# EAGLE design etch-a-sketch (EAGLE 9.6.2)
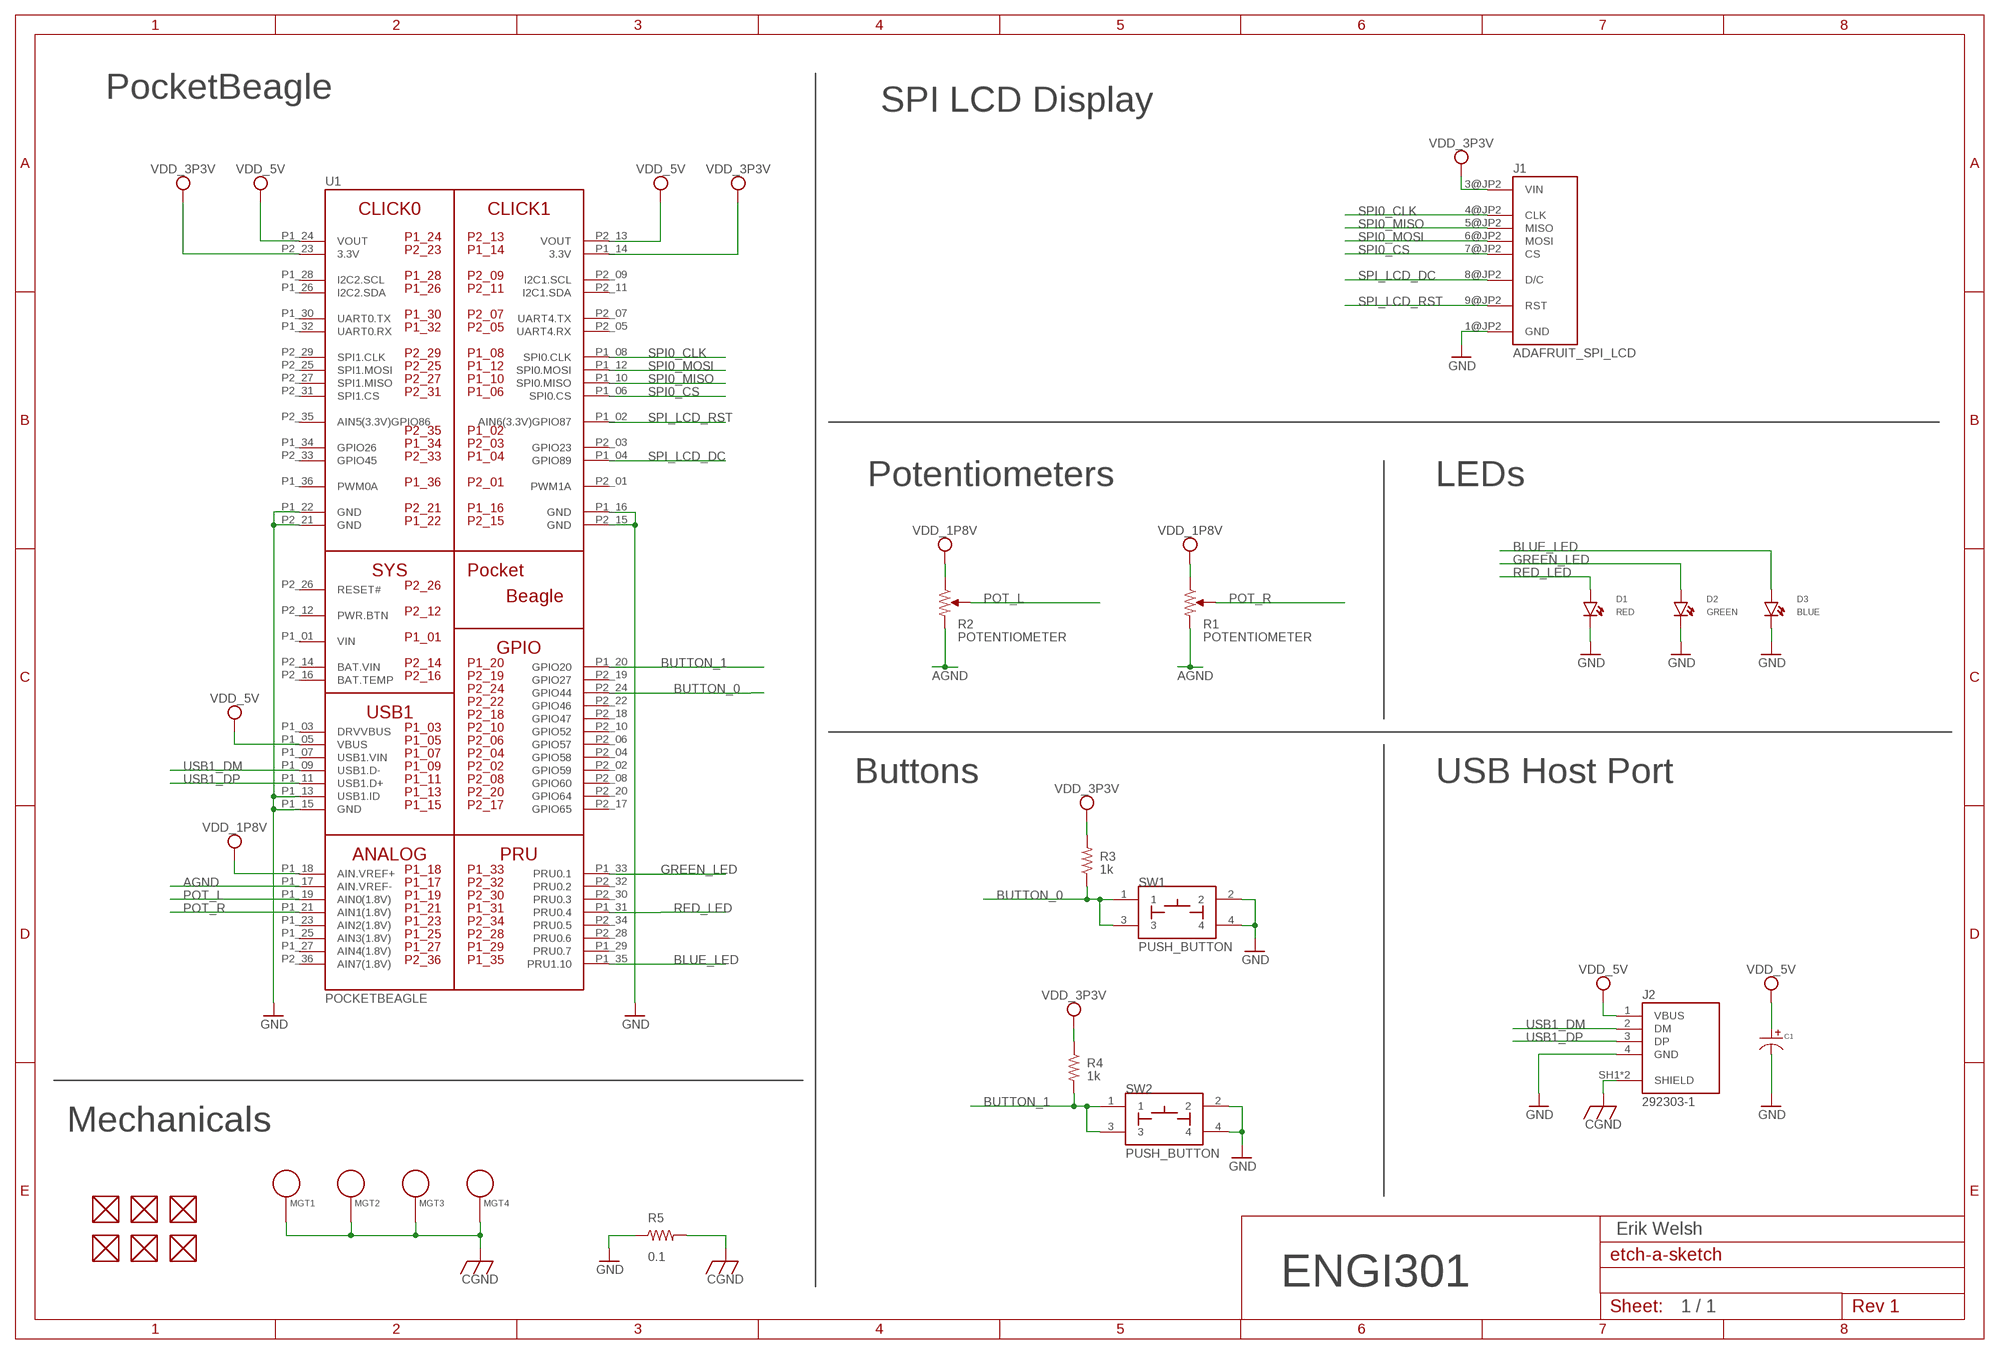
[diagram p0: schematic, sheet 1]

## Parts
C1  CAPACITOR_P_10MM  [CP10MM]
D1  RED  LED  [EIA-STD]
D2  GREEN  LED  [EIA-STD]
D3  BLUE  LED  [EIA-STD]
FUD1  FIDUCIAL  [FIDUCIAL_40MIL]
FUD2  FIDUCIAL  [FIDUCIAL_40MIL]
FUD3  FIDUCIAL  [FIDUCIAL_40MIL]
FUD4  FIDUCIAL  [FIDUCIAL_40MIL]
FUD5  FIDUCIAL  [FIDUCIAL_40MIL]
FUD6  FIDUCIAL  [FIDUCIAL_40MIL]
J1  ADAFRUIT_SPI_LCD  [SPI_LCD_DISPLAY]
J2  292303-1  [TE_292303-1]
MGT1  MOUNTING_HOLE  [MOUNTING_HOLE]
MGT2  MOUNTING_HOLE  [MOUNTING_HOLE]
MGT3  MOUNTING_HOLE  [MOUNTING_HOLE]
MGT4  MOUNTING_HOLE  [MOUNTING_HOLE]
R1  POTENTIOMETER  [POT-PO90S]
R2  POTENTIOMETER  [POT-PO90S]
R3  1k  R_R0603  [R0603]
R4  1k  R_R0603  [R0603]
R5  0.1  R_R0805  [R0805]
SW1  PUSH_BUTTON  [BUTTON_12.5MM]
SW2  PUSH_BUTTON  [BUTTON_12.5MM]
U1  POCKETBEAGLE  [POCKETBEAGLE]

## Nets
AGND: R1.CW R2.CW U1.P1_17(AIN.VREF-)
BLUE_LED: D3.ANODE U1.P1_35(PRU1.10)
BUTTON_0: R3.1 SW1.1 SW1.3 U1.P2_24(GPIO44)
BUTTON_1: R4.2 SW2.1 SW2.3 U1.P1_20(GPIO20)
CGND: J2.SH1(SHIELD) J2.SH2(SHIELD) MGT1.P$1 MGT2.P$1 MGT3.P$1 MGT4.P$1 R5.2
GND: C1.P$2 D1.CATHODE D2.CATHODE D3.CATHODE J1.1@JP2(GND) J2.4(GND) R5.1 SW1.2 SW1.4 SW2.2 SW2.4 U1.P1_13(USB1.ID) U1.P1_15(GND) U1.P1_16(GND) U1.P1_22(GND) U1.P2_15(GND) U1.P2_21(GND)
GREEN_LED: D2.ANODE U1.P1_33(PRU0.1)
N$2: U1.P1_14(3.3V) ; supply symbol labelled VDD_3P3V
POT_L: R2.S U1.P1_19(AIN0(1.8V))
POT_R: R1.S U1.P1_21(AIN1(1.8V))
RED_LED: D1.ANODE U1.P1_31(PRU0.4)
SPI0_CLK: J1.4@JP2(CLK) U1.P1_08(SPI0.CLK)
SPI0_CS: J1.7@JP2(CS) U1.P1_06(SPI0.CS)
SPI0_MISO: J1.5@JP2(MISO) U1.P1_10(SPI0.MISO)
SPI0_MOSI: J1.6@JP2(MOSI) U1.P1_12(SPI0.MOSI)
SPI_LCD_DC: J1.8@JP2(D/C) U1.P1_04(GPIO89)
SPI_LCD_RST: J1.9@JP2(RST) U1.P1_02(AIN6(3.3V)GPIO87)
USB1_DM: J2.2(DM) U1.P1_09(USB1.D-)
USB1_DP: J2.3(DP) U1.P1_11(USB1.D+)
VDD_1P8V: R1.CCW R2.CCW U1.P1_18(AIN.VREF+)
VDD_3P3V: J1.3@JP2(VIN) R3.2 R4.1 U1.P2_23(3.3V)
VDD_5V: C1.P$1 J2.1(VBUS) U1.P1_05(VBUS) U1.P1_24(VOUT) U1.P2_13(VOUT)
Unconnected: FUD1.P$1 FUD2.P$1 FUD3.P$1 FUD4.P$1 FUD5.P$1 FUD6.P$1 U1.P1_03(DRVVBUS) U1.P1_07(USB1.VIN) U1.P1_23(AIN2(1.8V)) U1.P1_25(AIN3(1.8V)) U1.P1_26(I2C2.SDA) U1.P1_27(AIN4(1.8V)) U1.P1_28(I2C2.SCL) U1.P1_29(PRU0.7) U1.P1_30(UART0.TX) U1.P1_32(UART0.RX) U1.P1_34(GPIO26) U1.P1_36(PWM0A) U1.P2_01(PWM1A) U1.P2_02(GPIO59) U1.P2_03(GPIO23) U1.P2_04(GPIO58) U1.P2_05(UART4.RX) U1.P2_06(GPIO57) U1.P2_07(UART4.TX) U1.P2_08(GPIO60) U1.P2_09(I2C1.SCL) U1.P2_10(GPIO52) U1.P2_11(I2C1.SDA) U1.P2_12(PWR.BTN) U1.P2_16(BAT.TEMP) U1.P2_17(GPIO65) U1.P2_18(GPIO47) U1.P2_19(GPIO27) U1.P2_20(GPIO64) U1.P2_22(GPIO46) U1.P2_25(SPI1.MOSI) U1.P2_26(RESET#) U1.P2_27(SPI1.MISO) U1.P2_28(PRU0.6) U1.P2_29(SPI1.CLK) U1.P2_30(PRU0.3) U1.P2_31(SPI1.CS) U1.P2_32(PRU0.2) U1.P2_33(GPIO45) U1.P2_34(PRU0.5) U1.P2_35(AIN5(3.3V)GPIO86) U1.P2_36(AIN7(1.8V))

## Notes on the sheet
- PocketBeagle
- SPI LCD Display
- Potentiometers | LEDs
- Buttons | USB Host Port
- Mechanicals
- Erik Welsh
- ENGI301
- 1 / 1

## Power pins joined to a net without a drawn wire
BAT.VIN: U1.P2_14(BAT.VIN)
VIN: U1.P1_01(VIN)

## Library data of the parts
C1 = etch-a-sketch:CAPACITOR_P: Library: MF_Passives Description: Device for Polarized Capacitors. Manufacture part number (MPN), Voltage Rating, and Tolerance can be added via Attributes. Check https://factory.macrofab.com/parts for the house parts list.; POPULATE: 1
D1-D3 = etch-a-sketch:LED: EIA-STD LED, LTST-C191TBKT
FUD1-FUD6 = etch-a-sketch:FIDUCIAL
J1 = etch-a-sketch:ADAFRUIT_SPI_LCD
J2 = etch-a-sketch:292303-1: CONN USB RECEPT R/A TYPE A 4POS Check availability <https://pricing.snapeda.com/parts/292303-1/TE%20Connectivity/view-part?ref=eda>; AVAILABILITY: In Stock; CENTERLINE_PITCH: 2 mm[.078 in]; COMMENT: 292303-1; DESCRIPTION: Conn; Data; USB; Recept; 2.0; 4 Pos; 1 Port; Rt Angle; A Ser; Tin over Copper; EU_ROHS_COMPLIANCE: Compliant; MF: TE Connectivity; MP: 292303-1; NUMBER_OF_POSITIONS: 4; PACKAGE: None; PRICE: None; PRODUCT_TYPE: Connector; PURCHASE-URL: https://pricing.snapeda.com/search/part/292303-1/?ref=eda
MGT1-MGT4 = etch-a-sketch:MOUNTING_HOLE: Chassis Mounting Hole w/GND connection ability
R1 R2 = etch-a-sketch:POTENTIOMETER: Potentiometer - Examples: P090S-14T20BR10K (987-1277-ND)
R3-R5 = etch-a-sketch:R_: RESISTOR, American symbol
SW1 SW2 = etch-a-sketch:PUSH_BUTTON
U1 = etch-a-sketch:POCKETBEAGLE

## Board
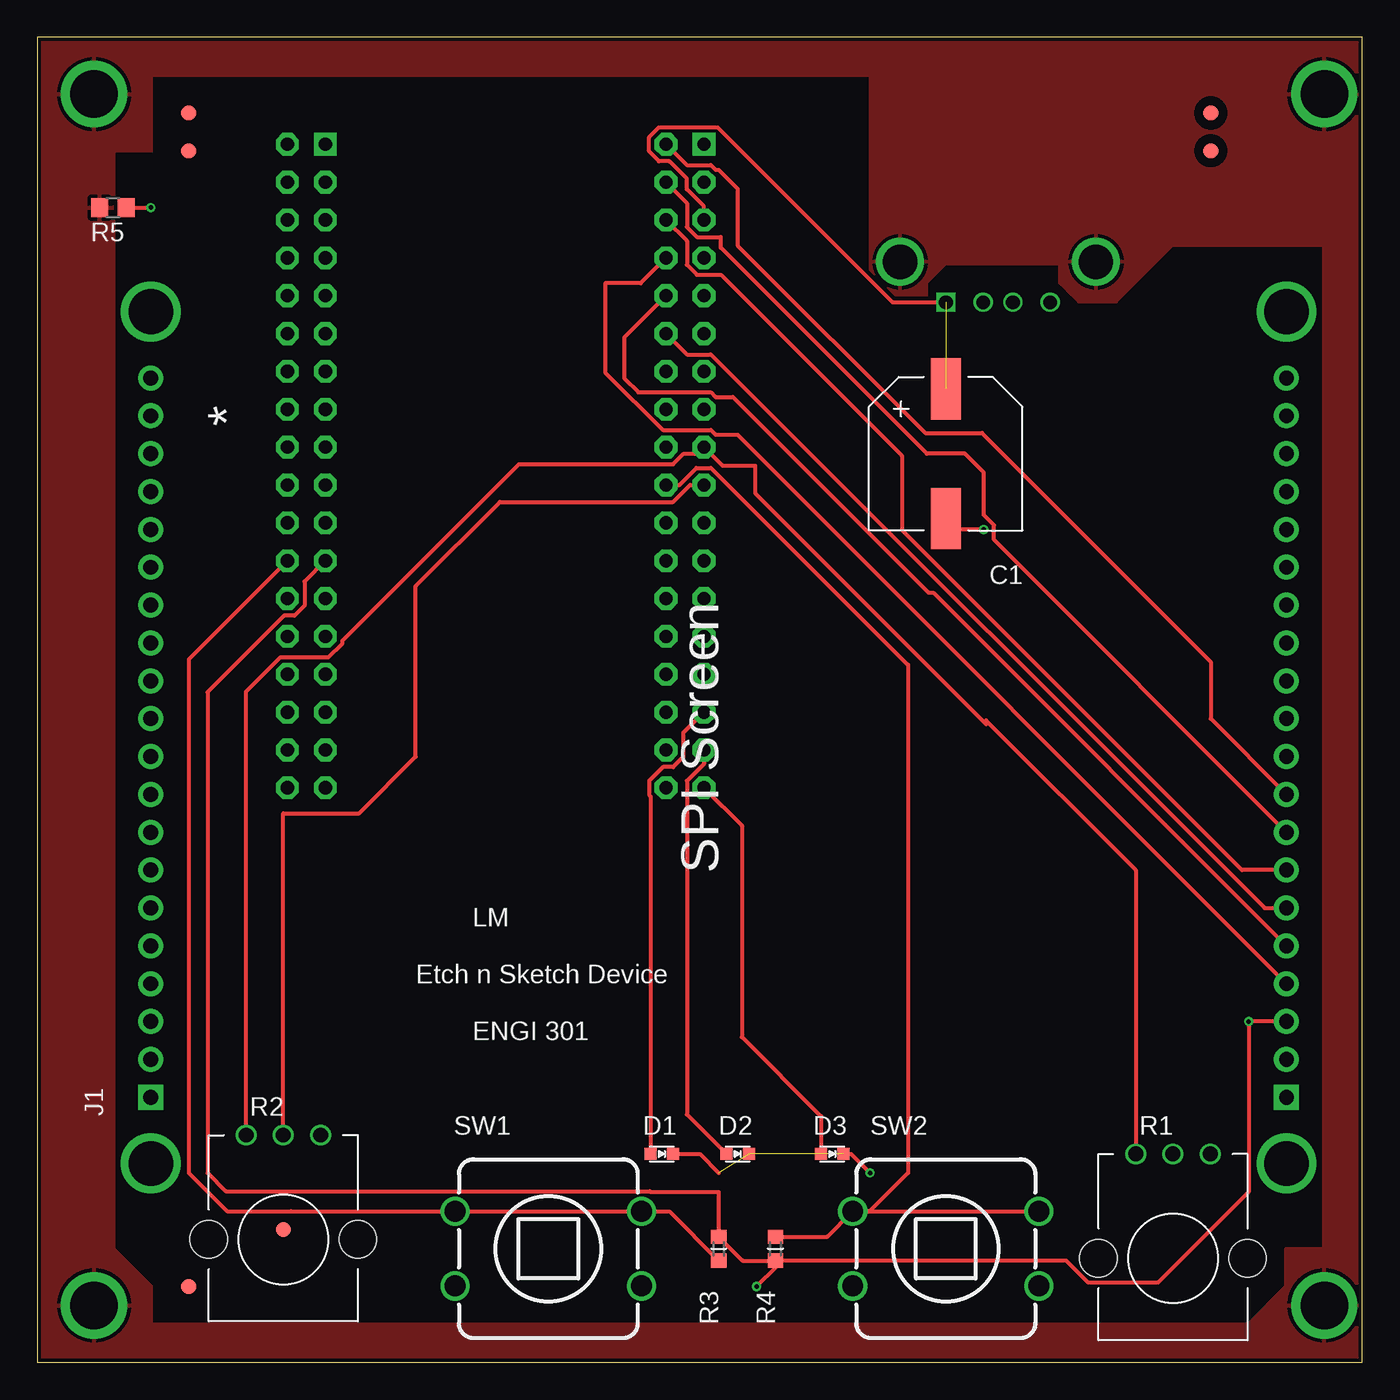
[diagram p1: board, top side]
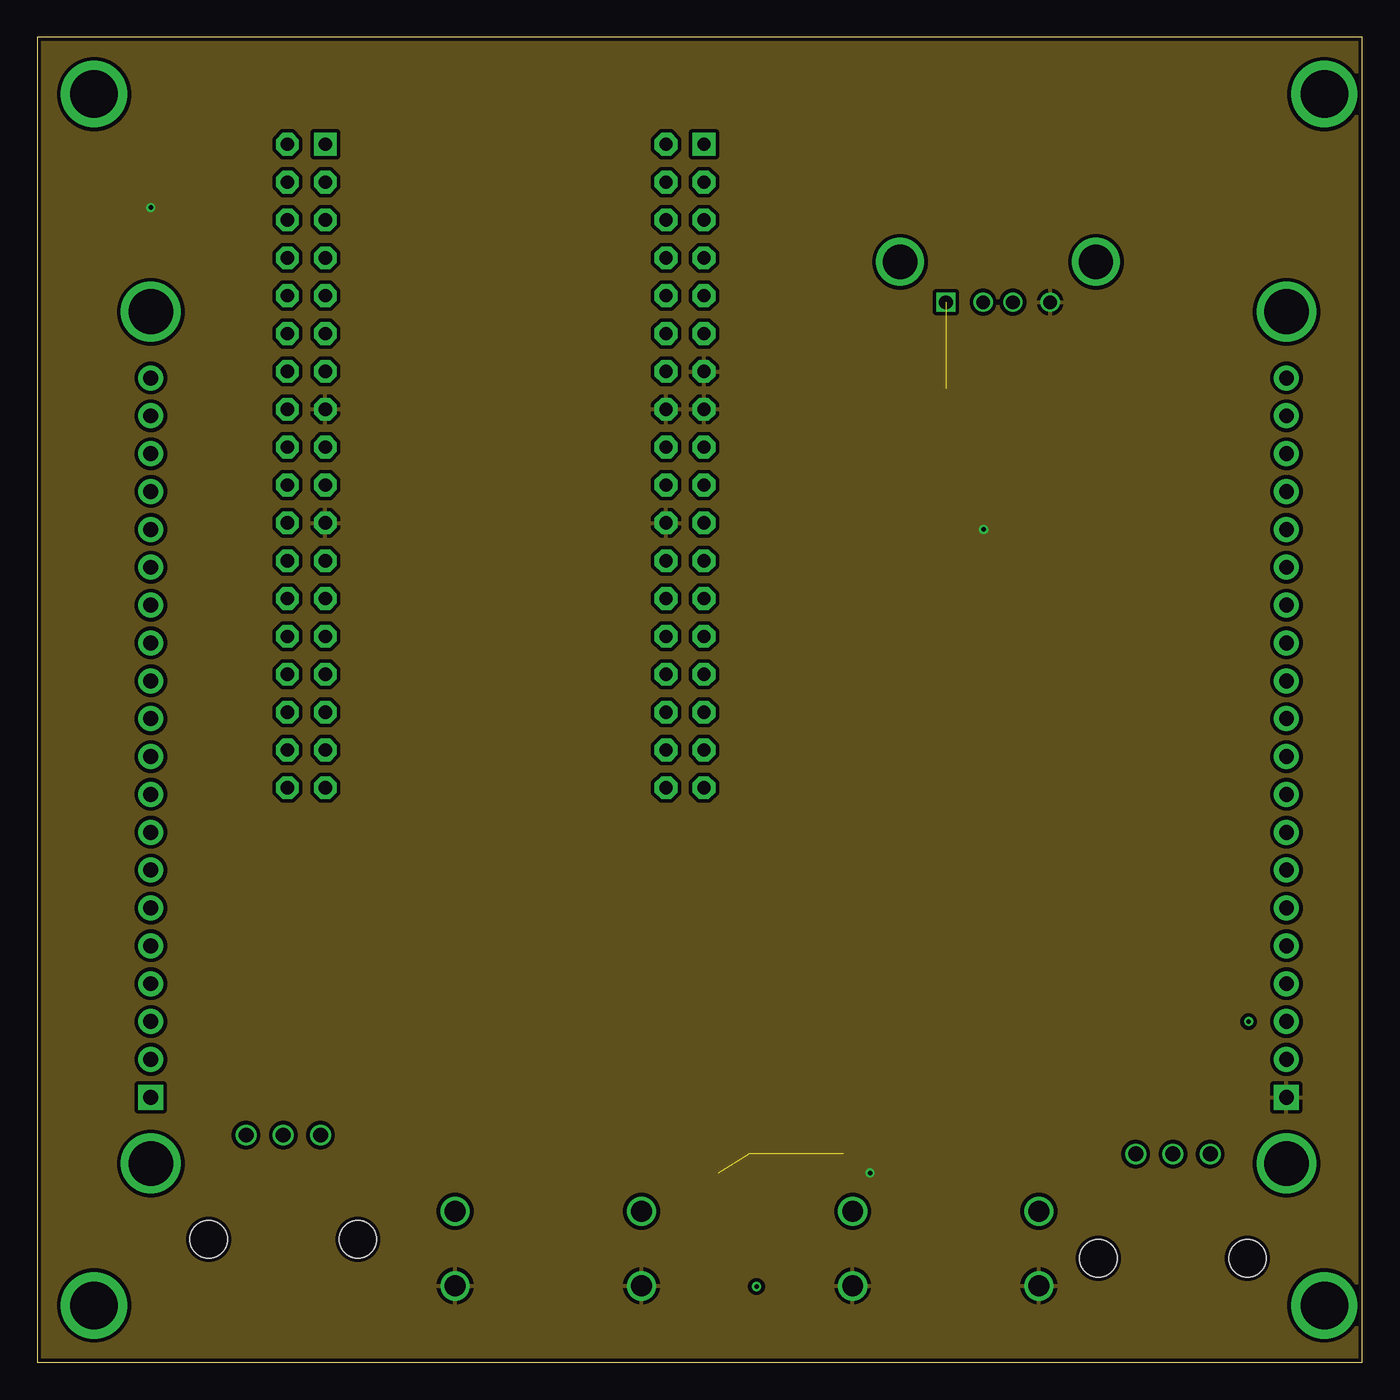
[diagram p2: board, inner layer Route2]
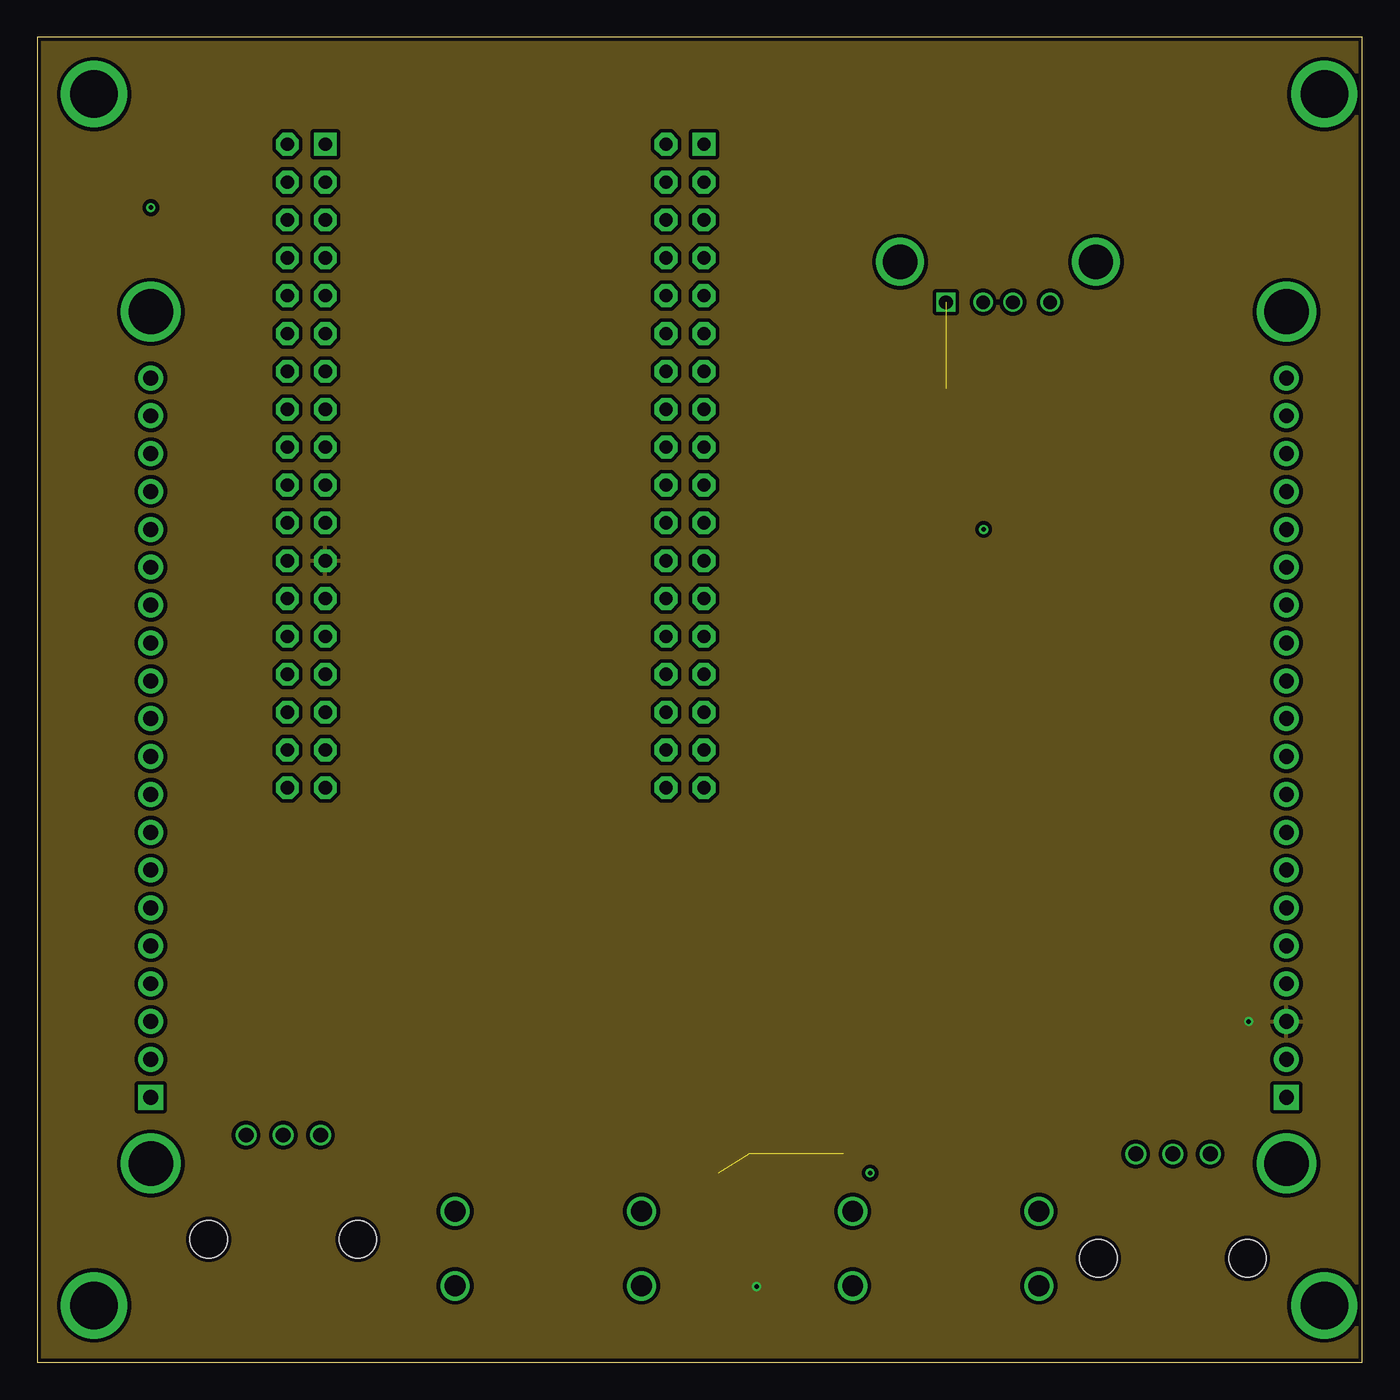
[diagram p3: board, inner layer Route15]
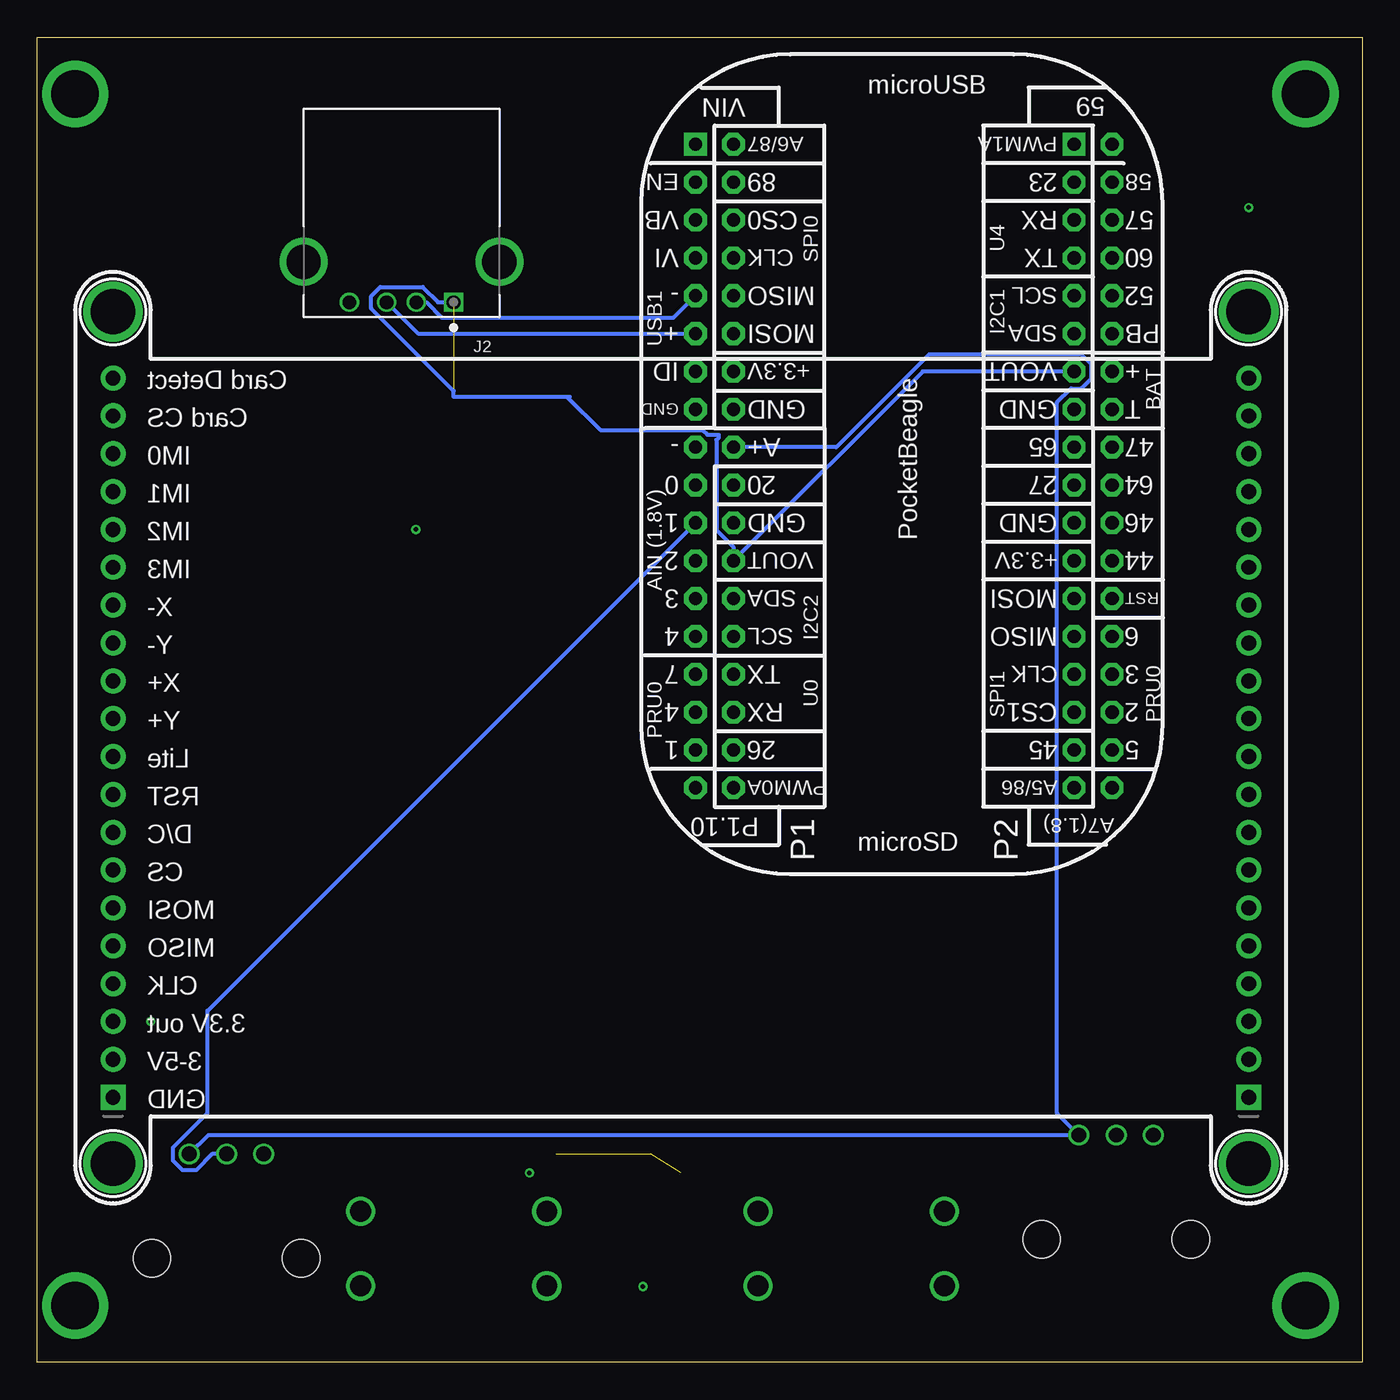
[diagram p4: board, bottom side, seen from below]

Size 88.9 x 88.9 mm. Coordinates in mm from the lower left corner, seen from the top.
Outline: 0,0 88.9,0 88.9,88.9 0,88.9 0,0
Copper layers (1*2*15*16): Top 0.035mm / dielectric 0.23mm / Route2 0.035mm / dielectric 0.93mm / Route15 0.035mm / dielectric 0.23mm / Bottom 0.035mm
Design rules "ENGI301_4lyr": minimum track width 10mil, minimum drill 12mil, track to track 10mil, track to pad 10mil, pad to pad 10mil, via to via 10mil, smd to smd 10mil, copper to edge 10mil, drill to drill 12mil, minimum pad ring 6mil, minimum via ring 6mil, stop-mask expansion 3mil, vias tented up to drill 25mil, thermal gap 10mil

### Footprints (pad centres in the part's own frame; a part is rotated, then mirrored left to right if it is on the bottom)
CP10MM = smd 2 x 4.1: P$1 0,-4.35; P$2 0,4.35
EIA-STD = smd 0.8 x 0.8: ANODE -0.75,0; CATHODE 0.75,0
FIDUCIAL_40MIL = smd 1.016 x 1.016: P$1 0,0
SPI_LCD_DISPLAY = drill 1 pad 1.676 square: 1@JP1 -24.13,38.1; 1@JP2 -24.13,-38.1 | drill 1 pad 1.676: 2@JP1 -21.59,38.1; 2@JP2 -21.59,-38.1; 3@JP1 -19.05,38.1; 3@JP2 -19.05,-38.1; 4@JP1 -16.51,38.1; 4@JP2 -16.51,-38.1; 5@JP1 -13.97,38.1; 5@JP2 -13.97,-38.1; 6@JP1 -11.43,38.1; 6@JP2 -11.43,-38.1; 7@JP1 -8.89,38.1; 7@JP2 -8.89,-38.1; 8@JP1 -6.35,38.1; 8@JP2 -6.35,-38.1; 9@JP1 -3.81,38.1; 9@JP2 -3.81,-38.1; 10@JP1 -1.27,38.1; 10@JP2 -1.27,-38.1; 11@JP1 1.27,38.1; 11@JP2 1.27,-38.1; 12@JP1 3.81,38.1; 12@JP2 3.81,-38.1; 13@JP1 6.35,38.1; 13@JP2 6.35,-38.1; 14@JP1 8.89,38.1; 14@JP2 8.89,-38.1; 15@JP1 11.43,38.1; 15@JP2 11.43,-38.1; 16@JP1 13.97,38.1; 16@JP2 13.97,-38.1; 17@JP1 16.51,38.1; 17@JP2 16.51,-38.1; 18@JP1 19.05,38.1; 18@JP2 19.05,-38.1; 19@JP1 21.59,38.1; 19@JP2 21.59,-38.1; 20@JP1 24.13,38.1; 20@JP2 24.13,-38.1 | drill 3 pad 3.6: P$1@U$7 28.575,-38.1; P$1@U$15 -28.575,-38.1; P$1@U$16 28.575,38.1; P$1@U$17 -28.575,38.1
TE_292303-1 = drill 0.92 square: 1 0,0 | drill 0.92: 2 2.5,0; 3 4.5,0; 4 7,0 | drill 2.3: SH1 -3.07,-2.71; SH2 10.07,-2.71
MOUNTING_HOLE = drill 3.175 pad 4.445: P$1 0,0
POT-PO90S = drill 1: CCW -2.5,0; CW 2.5,0; S 0,0 | hole 2.5: -5,7; 5,7
R0603 = smd 0.95 x 1.031: 1 -0.8,0; 2 0.8,0
R0805 = smd 1.143 x 1.27: 1 -0.889,0; 2 0.889,0
BUTTON_12.5MM = drill 1.4: 1 -6.25,2.5; 2 -6.25,-2.5; 3 6.25,2.5; 4 6.25,-2.5
POCKETBEAGLE = drill 0.889 pad 1.524 square: P1_01 5.91,3.53; P2_01 5.91,28.93 | drill 0.889 pad 1.524 octagon: P1_02 5.91,6.07; P1_03 8.45,3.53; P1_04 8.45,6.07; P1_05 10.99,3.53; P1_06 10.99,6.07; P1_07 13.53,3.53; P1_08 13.53,6.07; P1_09 16.07,3.53; P1_10 16.07,6.07; P1_11 18.61,3.53; P1_12 18.61,6.07; P1_13 21.15,3.53; P1_14 21.15,6.07; P1_15 23.69,3.53; P1_16 23.69,6.07; P1_17 26.23,3.53; P1_18 26.23,6.07; P1_19 28.77,3.53; P1_20 28.77,6.07; P1_21 31.31,3.53; P1_22 31.31,6.07; P1_23 33.85,3.53; P1_24 33.85,6.07; P1_25 36.39,3.53; P1_26 36.39,6.07; P1_27 38.93,3.53; P1_28 38.93,6.07; P1_29 41.47,3.53; P1_30 41.47,6.07; P1_31 44.01,3.53; P1_32 44.01,6.07; P1_33 46.55,3.53; P1_34 46.55,6.07; P1_35 49.09,3.53; P1_36 49.09,6.07; P2_02 5.91,31.47; P2_03 8.45,28.93; P2_04 8.45,31.47; P2_05 10.99,28.93; P2_06 10.99,31.47; P2_07 13.53,28.93; P2_08 13.53,31.47; P2_09 16.07,28.93; P2_10 16.07,31.47; P2_11 18.61,28.93; P2_12 18.61,31.47; P2_13 21.15,28.93; P2_14 21.15,31.47; P2_15 23.69,28.93; P2_16 23.69,31.47; P2_17 26.23,28.93; P2_18 26.23,31.47; P2_19 28.77,28.93; P2_20 28.77,31.47; P2_21 31.31,28.93; P2_22 31.31,31.47; P2_23 33.85,28.93; P2_24 33.85,31.47; P2_25 36.39,28.93; P2_26 36.39,31.47; P2_27 38.93,28.93; P2_28 38.93,31.47; P2_29 41.47,28.93; P2_30 41.47,31.47; P2_31 44.01,28.93; P2_32 44.01,31.47; P2_33 46.55,28.93; P2_34 46.55,31.47; P2_35 49.09,28.93; P2_36 49.09,31.47

### Placement (x,y rotation side)
C1  60.96,60.96 180 top
D1  41.91,13.97 0 top
D2  46.99,13.97 0 top
D3  53.34,13.97 0 top
FUD1  10.16,83.82 0 top
FUD2  10.16,81.28 0 top
FUD3  78.74,83.82 0 top
FUD4  78.74,81.28 0 top
FUD5  10.16,5.08 0 top
FUD6  16.51,8.89 0 top
J1  45.72,41.91 90 top
J2  60.96,71.12 180 bottom
MGT1  3.81,85.09 0 top
MGT2  3.81,3.81 0 top
MGT3  86.36,3.81 0 top
MGT4  86.36,85.09 0 top
R1  76.2,13.97 180 top
R2  16.51,15.24 180 top
R3  45.72,7.62 90 top
R4  49.53,7.62 90 top
R5  5.08,77.47 180 top
SW1  34.29,7.62 0 top
SW2  60.96,7.62 0 top
U1  48.26,87.63 270 bottom

### Tracks (layer width: path | path; a pad name or v marks a point on that pad's centre or on a via)
AGND
  Top 0.254: R1.CW 73.7,33.02 63.65,43.07 63.65,42.82 48.16,58.32 48.16,60.13 46,60.13 U1.P1_17 44.73,60.96 43.37,60.96 42.66,60.26 32.32,60.26 20.47,48.41 20.47,48.23 19.55,47.3 16.32,47.3 14.01,45 R2.CW
BLUE_LED
  Top 0.254: U1.P1_35 47.27,36 47.27,21.83 52.59,16.51 D3.ANODE
BUTTON_0
  Top 0.254: R3.1 42.42,10.12 SW1.3 SW1.1 17.03,10.12 17.02,10.13 12.73,10.13 10.16,12.7 10.16,47.15 U1.P2_24
BUTTON_1
  Top 0.254: R4.2 53.01,8.42 SW2.1 | SW2.1 SW2.3 | U1.P1_20 43.09,58.86 44.23,60 45.2,60 58.42,46.79 58.42,12.7 55.84,10.12 SW2.1
CGND
  pour Top: -2.54,45.72 5.08,45.72 5.08,7.62 7.62,5.08 7.62,2.54 81.28,2.54 83.82,5.08 83.82,7.62 86.36,7.62 86.36,45.72 91.44,45.72 91.44,-2.54 -2.54,-2.54 -2.54,2.54
  pour Top: -2.54,45.72 -2.54,93.98 91.44,93.98 91.44,45.72 86.36,45.72 86.36,81.28 81.28,81.28 81.28,86.36 7.62,86.36 7.62,81.28 5.08,81.28 5.08,45.72
  pour Top: 55.88,86.36 55.88,71.12 59.69,71.12 59.69,72.39 60.96,73.66 68.58,73.66 68.58,72.39 69.85,71.12 72.39,71.12 76.2,74.93 86.36,74.93 86.36,81.28 81.28,81.28 81.28,86.36
GND  (via drill 0.3 pad 0.61)  (2 unrouted)
  Top 0.254: R5.1 v7.62,77.47 | D3.CATHODE 54.61,13.97 v55.88,12.7 | v63.5,55.88 61.69,55.88 C1.P$2 | D1.CATHODE 44.45,13.97 45.72,12.7
  pour Route2: -5.08,93.98 93.98,93.98 93.98,-5.08 -5.08,-5.08
GREEN_LED
  Top 0.254: U1.P1_33 44.73,40.16 43.59,39.01 43.59,16.62 D2.ANODE
POT_L
  Top 0.254: R2.S 16.51,36.83 21.59,36.83 25.4,40.64 25.4,52.07 31.05,57.72 42.66,57.72 43.81,58.86 U1.P1_19
POT_R
  Bottom 0.254: R1.S 77.17,13.97 78.25,12.89 79.15,12.89 79.78,13.52 79.78,14.42 77.47,16.73 77.47,23.58 U1.P1_21
RED_LED
  Top 0.254: D1.ANODE 41.16,37.95 41.05,38.07 41.05,39.01 41.97,39.94 42.66,39.94 43.33,40.61 43.33,42.22 U1.P1_31
SPI0_CLK
  Top 0.254: U1.P1_08 40.48,72.39 38.1,72.39 38.1,66.41 41.97,62.54 45.2,62.54 45.52,62.23 46.99,62.23 J1.4@JP2
SPI0_CS
  Top 0.254: U1.P1_06 43.59,75.24 43.59,73.63 44.26,72.96 45.87,72.96 58,60.83 58,55.85 80.83,33.02 J1.7@JP2
SPI0_MISO
  Top 0.254: U1.P1_10 39.37,68.74 39.37,66.04 40.33,65.08 45.2,65.08 45.52,64.77 46.67,64.77 59.8,51.64 60.12,51.64 J1.5@JP2
SPI0_MOSI
  Top 0.254: U1.P1_12 43.59,67.62 45.2,67.62 82.35,30.48 J1.6@JP2
SPI_LCD_DC
  Top 0.254: U1.P1_04 43.59,77.78 43.59,76.17 44.26,75.5 45.87,75.5 45.87,74.78 59.69,60.96 62.23,60.96 63.5,59.69 63.5,56.85 64.19,56.16 64.19,55.19 J1.8@JP2
SPI_LCD_RST
  Top 0.254: U1.P1_02 43.59,80.32 45.2,80.32 45.52,80.01 45.72,80.01 46.99,78.74 46.99,74.93 59.58,62.34 63.39,62.34 78.74,46.99 78.74,43.18 J1.9@JP2
USB1_DM
  Bottom 0.254: J2.2 62.79,71.12 61.76,70.09 46.2,70.09 U1.P1_09
USB1_DP
  Bottom 0.254: J2.3 63.36,69.02 U1.P1_11
VDD_1P8V
  Bottom 0.254: R1.CCW 77.43,15.24 R2.CCW 20.47,16.7 20.47,64.41 19.55,65.34 18.86,65.34 18.19,66.01 18.19,66.95 18.86,67.62 29.07,67.62 35.29,61.4 U1.P1_18
VDD_3P3V  (via drill 0.3 pad 0.61)
  Top 0.254: R4.1 49.53,6.35 v48.26,5.08 | J1.3@JP2 v81.28,22.86 81.28,11.43 75.19,5.34 70.52,5.34 69.04,6.82 R4.1 | R4.1 47.32,6.82 R3.2 45.72,11.43 41.16,11.43 41.1,11.48 12.65,11.48 11.43,12.7 11.43,44.96 16.57,50.1 17.26,50.1 17.93,50.77 17.93,52.38 U1.P2_23
  pour Route15: -10.16,99.06 96.52,99.06 99.06,99.06 99.06,-10.16 -10.16,-10.16
VDD_5V  (1 unrouted)
  Top 0.254: J2.1 57.39,71.12 45.65,82.86 41.72,82.86 41.05,82.19 41.05,81.25 41.72,80.58 42.41,80.58 43.59,79.4 43.59,78.71 44.73,77.56 U1.P1_05
  Bottom 0.254: 53.18,64.77 53.34,64.77 | 53.34,64.77 60.96,64.77 60.96,65.17 66.48,70.69 66.48,71.55 65.89,72.14 63.03,72.14 62.01,71.12 J2.1 | 53.34,64.77 51.11,62.54 44.26,62.54 43.94,62.23 43.18,62.23 43.18,62.03 43.33,61.87 43.33,55.85 42.19,54.7 U1.P1_24 29.49,66.48 U1.P2_13

### Text on the board
tPlace: LM | Etch n Sketch Device | ENGI 301